# EAGLE design switch sheild 1 (EAGLE 8.3.1)
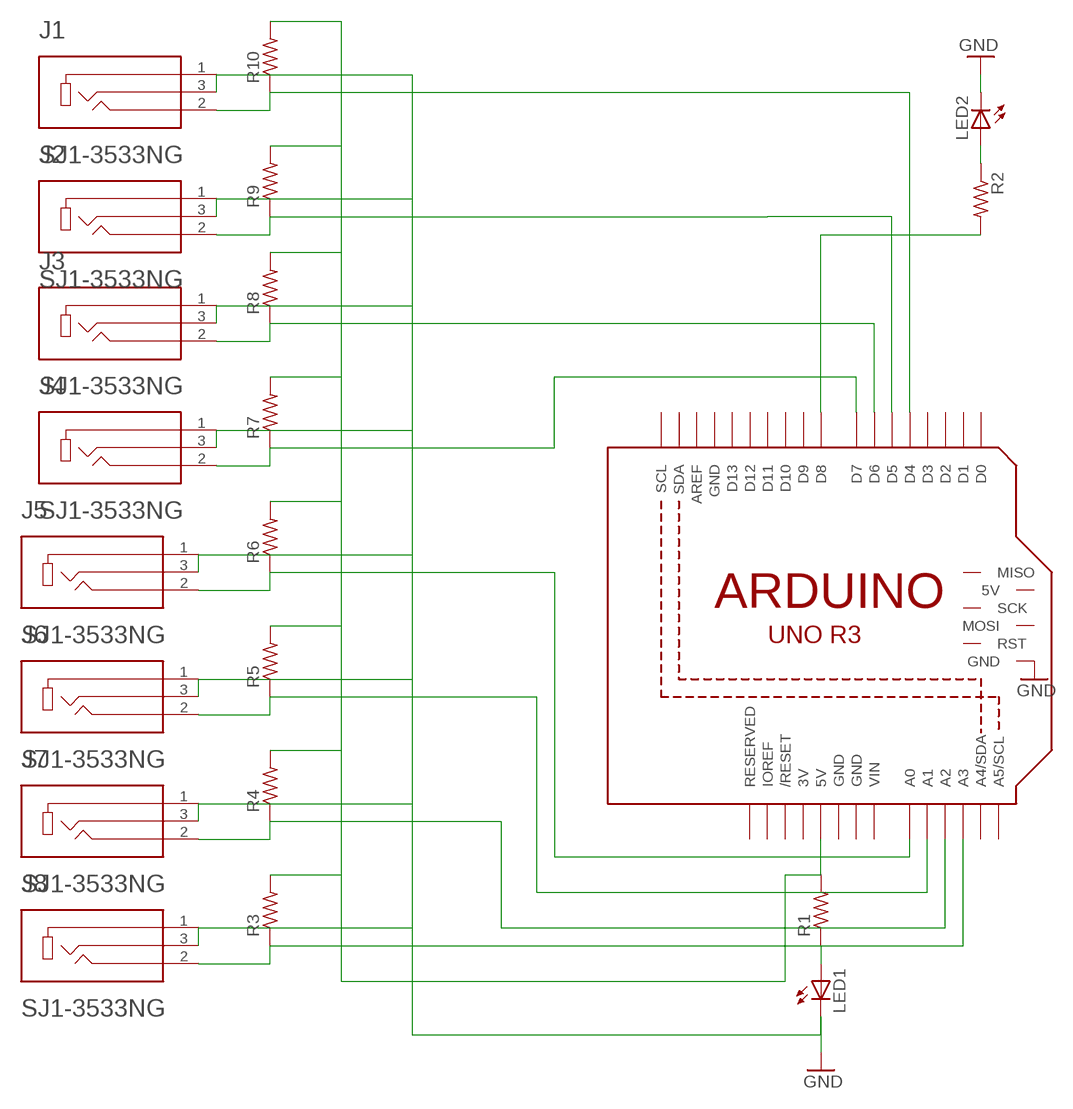
[diagram p0: schematic, sheet 1]

## Parts
J1  SJ1-3533NG  [CUI_SJ1-3533NG]
J2  SJ1-3533NG  [CUI_SJ1-3533NG]
J3  SJ1-3533NG  [CUI_SJ1-3533NG]
J4  SJ1-3533NG  [CUI_SJ1-3533NG]
J5  SJ1-3533NG  [CUI_SJ1-3533NG]
J6  SJ1-3533NG  [CUI_SJ1-3533NG]
J7  SJ1-3533NG  [CUI_SJ1-3533NG]
J8  SJ1-3533NG  [CUI_SJ1-3533NG]
LED1  LED3MM  [LED3MM]
LED2  LED3MM  [LED3MM]
M1  ARDUINO_R3_ICSP  [ARDUINOR3_ICSP]
R1  R-US_0207/5V  [0207/5V]
R2  R-US_0207/5V  [0207/5V]
R3  R-US_0207/5V  [0207/5V]
R4  R-US_0207/5V  [0207/5V]
R5  R-US_0207/5V  [0207/5V]
R6  R-US_0207/5V  [0207/5V]
R7  R-US_0207/5V  [0207/5V]
R8  R-US_0207/5V  [0207/5V]
R9  R-US_0207/5V  [0207/5V]
R10  R-US_0207/5V  [0207/5V]

## Nets
GND: J1.1 J1.3 J2.1 J2.3 J3.1 J3.3 J4.1 J4.3 J5.1 J5.3 J6.1 J6.3 J7.1 J7.3 J8.1 J8.3 LED1.K(C) LED2.K(C) M1.GND@2(GND)
N$1: M1.D8 R2.2
N$2: M1.5V R1.2 R3.2 R4.2 R5.2 R6.2 R7.2 R8.2 R9.2 R10.2
N$4: J1.2 M1.D4 R10.1
N$5: J2.2 M1.D5 R9.1
N$6: J3.2 M1.D6 R8.1
N$7: J4.2 M1.D7 R7.1
N$8: LED1.A R1.1
N$9: J5.2 M1.A0 R6.1
N$10: J6.2 M1.A1 R5.1
N$11: J7.2 M1.A2 R4.1
N$12: J8.2 M1.A3 R3.1
N$41: LED2.A R2.1
Unconnected: M1.5V_ICSP(5V) M1.A4(A4/SDA) M1.A5(A5/SCL) M1.AREF M1.D0 M1.D1 M1.D2 M1.D3 M1.D9 M1.D10 M1.D11 M1.D12 M1.D13 M1.IOREF M1.MISO M1.MOSI M1.RESERVED M1.RESET(/RESET) M1.RESET_ICSP(RST) M1.SCK M1.SCL M1.SDA

## Power pins joined to a net without a drawn wire
3V: M1.3V
GND: M1.GND M1.GND@1(GND) M1.GND@3(GND)
VIN: M1.VIN

## Library data of the parts
J1-J8 = SJ1-3533NG:SJ1-3533NG: 3.5 mm Right-Angle Stereo Jack, 3 Pin PCB Mount, Isolated Ground; MANUFACTURER: CUI; PARTREV: 1.02; STANDARD: Manufacturer recommendation
LED1 LED2 = adafruit:LED: LED OSRAM: - CHIPLED LG R971, LG N971, LY N971, LG Q971, LY Q971, LO R971, LY R971 LH N974, LH R974 LS Q976, LO Q976, LY Q976 LO Q996 - Hyper CHIPLED LW Q18S LB Q993, LB Q99A, LB R99A - SideLED LS A670, LO A670, LY A670, LG A670, LP A670 LB A673, LV A673, LT A673, LW A673 LH A674 LY A675 LS A676, LA A676, LO A676, LY A676, LW A676 LS A679, LY A679, LG A679 - Hyper Micro SIDELED® LS Y876, LA Y876, LO Y876, LY Y876 LT Y87S - SmartLED LW L88C, LW L88S LB L89C, LB L89S, LG L890 LS L89K, LO L89K, LY L89K LS L896, LA L896, LO L896, LY L896 - TOPLED LS T670, LO T670, LY T670, LG T670, LP T670 LSG T670, LSP T670, LSY T670, LOP T670, LYG T670 LG T671, LOG T671, LSG T671 LB T673, LV T673, LT T673, LW T673 LH T674 LS T676, LA T676, LO T676, LY T676, LB T676, LH T676, LSB T676, LW T676 LB T67C, LV T67C, LT T67C, LS T67K, LO T67K, LY T67K, LW E67C LS E67B, LA E67B, LO E67B, LY E67B, LB E67C, LV E67C, LT E67C LW T67C LS T679, LY T679, LG T679 LS T770, LO T770, LY T770, LG T770, LP T770 LB T773, LV T773, LT T773, LW T773 LH T774 LS E675, LA E675, LY E675, LS T675 LS T776, LA T776, LO T776, LY T776, LB T776 LHGB T686 LT T68C, LB T68C - Hyper Mini TOPLED® LB M676 - Mini TOPLED Santana® LG M470 LS M47K, LO M47K, LY M47K Source: http://www.osram.convergy.de/
M1 = adafruit:ARDUINO_R3_ICSP
R1-R10 = rcl-ez:R-US_: RESISTOR, American symbol

## Board
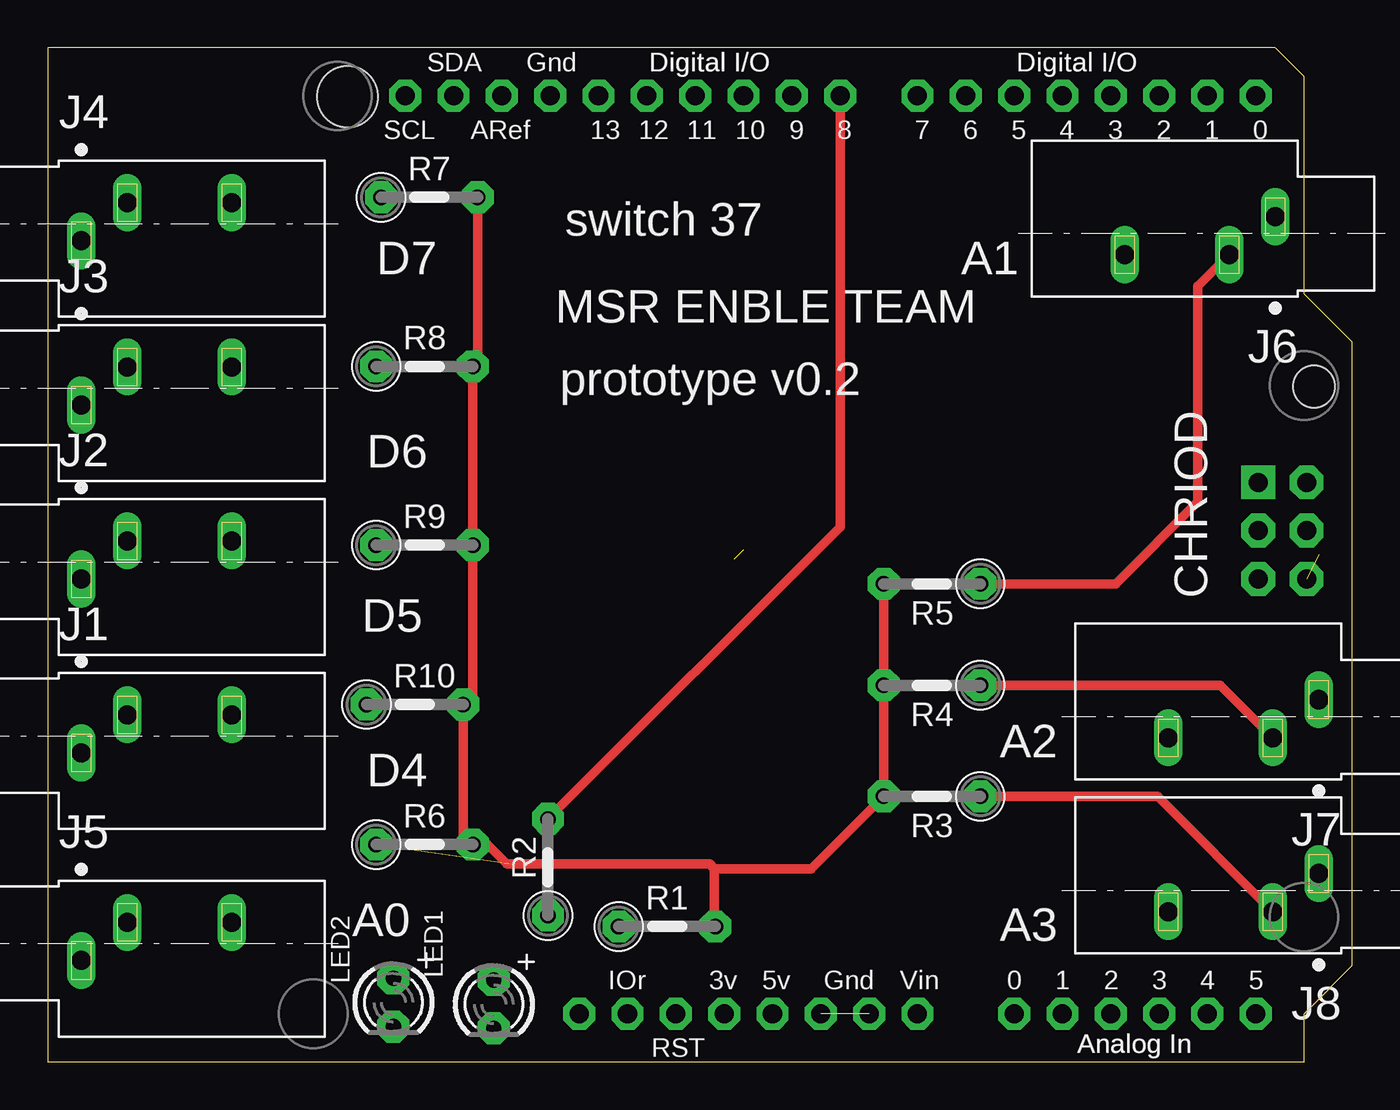
[diagram p1: board, top side]
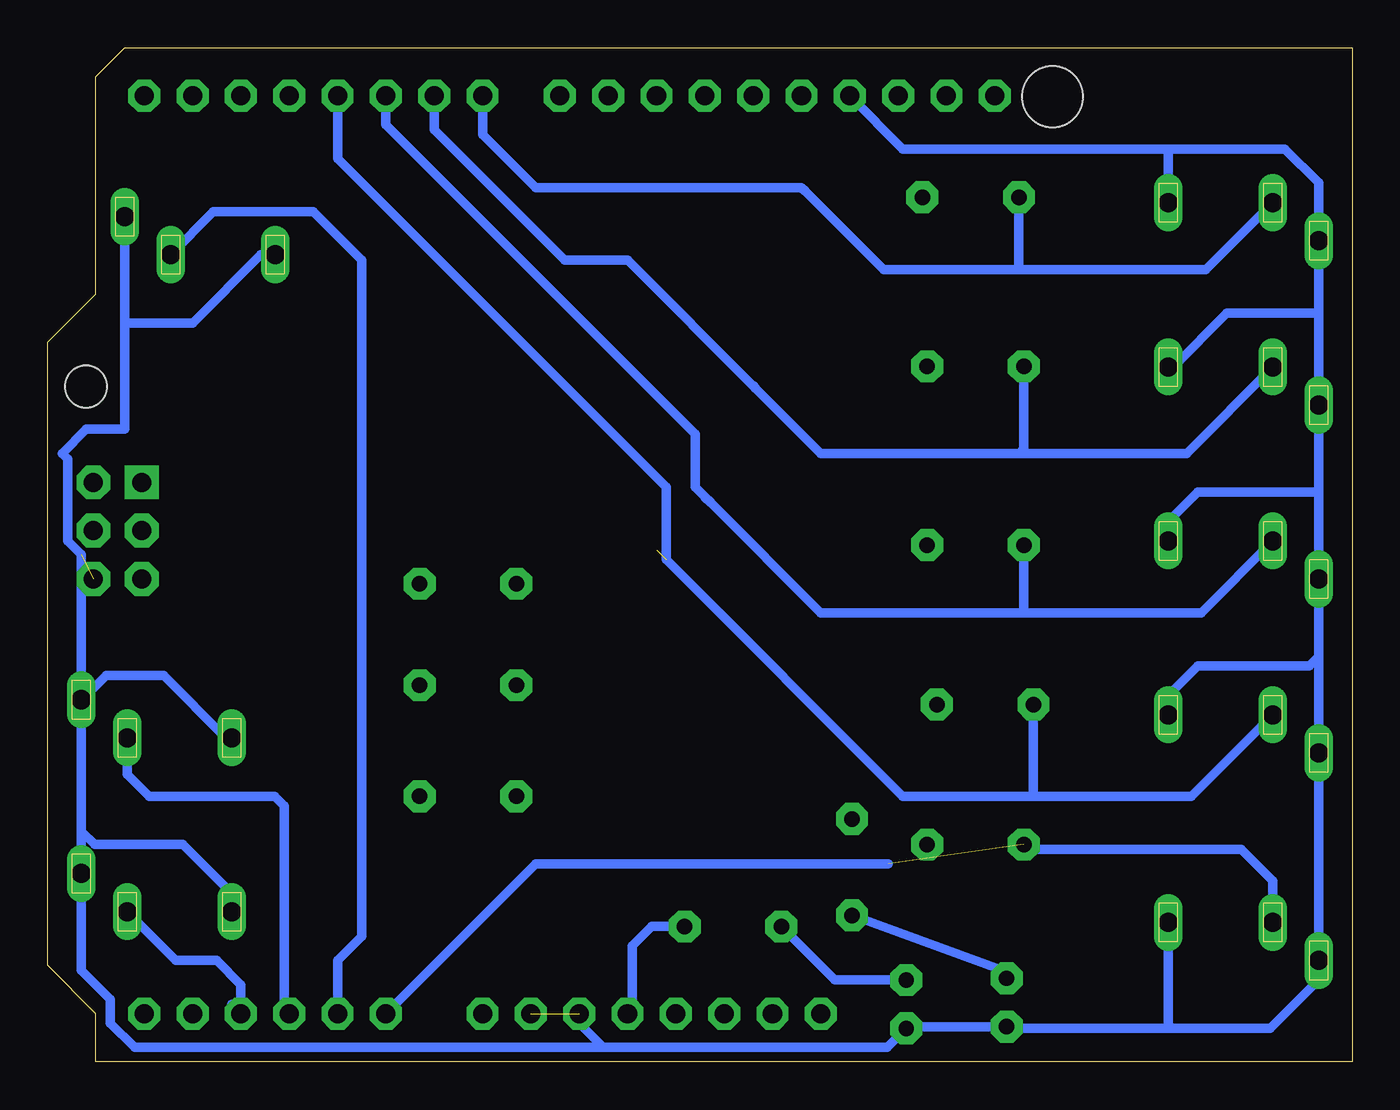
[diagram p2: board, bottom side, seen from below]

Size 68.58 x 53.34 mm. Coordinates in mm from the lower left corner, seen from the top.
Copper layers (1*16): Top 0.035mm / dielectric 1.5mm / Bottom 0.035mm
Design rules "adafruit": minimum track width 8mil, minimum drill 15.5mil, track to track 8mil, track to pad 8mil, pad to pad 8mil, via to via 8mil, smd to smd 8mil, copper to edge 10mil, drill to drill 8mil, minimum pad ring 10mil, minimum via ring 8mil, stop-mask expansion 2mil, vias tented up to drill 20mil, thermal gap 10mil
Holes 3.2 mm at 15.76,50.75
Holes 2.2 mm at 66.56,35.51

### Footprints (pad centres in the part's own frame; a part is rotated, then mirrored left to right if it is on the bottom)
CUI_SJ1-3533NG = drill 1 long: 1 0,0; 2 2.4,2; 3 7.9,2
LED3MM = drill 0.813 pad 1.676 octagon: A -1.27,0; K 1.27,0
ARDUINOR3_ICSP = drill 1 pad 1.676 octagon: 3V 35.56,2.54; 5V 38.1,2.54; A0 50.8,2.54; A1 53.34,2.54; A2 55.88,2.54; A3 58.42,2.54; A4 60.96,2.54; A5 63.5,2.54; AREF 23.876,50.8; D0 63.5,50.8; D1 60.96,50.8; D2 58.42,50.8; D3 55.88,50.8; D4 53.34,50.8; D5 50.8,50.8; D6 48.26,50.8; D7 45.72,50.8; D8 41.656,50.8; D9 39.116,50.8; D10 36.576,50.8; D11 34.036,50.8; D12 31.496,50.8; D13 28.956,50.8; GND 26.416,50.8; GND@1 43.18,2.54; GND@2 40.64,2.54; IOREF 30.48,2.54; RESERVED 27.94,2.54; RESET 33.02,2.54; SCL 18.796,50.8; SDA 21.336,50.8; VIN 45.72,2.54 | drill 1 pad 1.778 octagon: 5V_ICSP 66.167,30.48; GND@3 66.167,25.4; MOSI 66.167,27.94; RESET_ICSP 63.627,25.4; SCK 63.627,27.94 | drill 1 pad 1.778 square: MISO 63.627,30.48
0207/5V = drill 0.813 pad 1.676 octagon: 1 -2.54,0; 2 2.54,0

### Placement (x,y rotation side)
J1  1.78,16.26 0 top
J2  1.78,25.4 0 top
J3  1.78,34.54 0 top
J4  1.78,43.18 0 top
J5  1.78,5.33 0 top
J6  64.52,44.45 180 top
J7  66.8,19.05 180 top
J8  66.8,9.91 180 top
LED1  23.45,3.04 270 top
LED2  18.17,3.13 270 top
M1  0,0 0 top
R1  32.56,7.12 0 top
R2  26.3,10.24 90 top
R3  46.48,13.97 180 top
R4  46.48,19.81 180 top
R5  46.48,25.15 180 top
R6  19.81,11.43 0 top
R7  20.07,45.47 0 top
R8  19.81,36.58 0 top
R9  19.81,27.18 0 top
R10  19.3,18.8 0 top

### Tracks (layer width: path | path; a pad name or v marks a point on that pad's centre or on a via)
GND  (2 unrouted)
  Bottom 0.508: 66.55,25.02 M1.GND@3 | 9.48,1.78 4.32,1.78 1.78,4.32 J5.1 1.78,16.12 J1.1 1.78,21.33 | 9.48,1.78 18.09,1.78 LED2.K 23.36,1.86 LED1.K 24.45,0.76 39.37,0.76 | M1.GND@2 40.64,2.03 39.37,0.76 | 1.78,21.33 1.78,25.07 J2.1 1.78,30.02 | 1.78,30.02 J3.1 1.78,39.28 | 1.78,39.28 J4.1 1.78,46.23 3.56,48.01 9.49,48.01 | 9.49,48.01 23.62,48.01 M1.GND | 64.52,38.71 J6.1 | 64.52,38.71 64.52,33.27 66.55,33.27 67.82,32 67.51,31.7 67.51,27.38 66.8,26.67 J7.1 | 66.8,19.01 66.8,18.68 | 66.8,19.01 J7.1 | 66.8,12.13 66.8,10.2 | 66.8,12.13 66.8,19.01 | 66.8,19.01 J7.1 | 66.8,10.2 J8.1 | 39.37,0.76 64.01,0.76 65.28,2.03 65.28,3.3 66.8,4.83 66.8,10.2 | J4.3 9.68,47.82 9.49,48.01 | J3.3 9.43,36.54 6.6,39.37 1.87,39.37 1.78,39.28 | J2.3 9.68,28.42 8.13,29.97 1.82,29.97 1.78,30.02 | J1.3 9.68,19.28 8.13,20.83 2.28,20.83 1.78,21.33 | J6.3 57.37,42.45 60.96,38.86 64.36,38.86 64.52,38.71 | J7.3 59.21,17.05 62.48,20.32 65.49,20.32 66.8,19.01 | J5.3 9.68,1.98 9.48,1.78 | J8.3 58.9,8.86 61.47,11.43 66.1,11.43 66.8,12.13
N$1
  Top 0.508: M1.D8 41.66,28.14 R2.2
N$2
  Top 0.508: R7.2 22.61,36.83 R8.2 R9.2 22.35,19.3 R10.2 21.84,11.94 R6.2 23.11,11.43 24.13,10.41 34.8,10.41 35.05,10.16 | 35.05,10.16 35.05,7.08 | 35.05,6.6 35.05,7.08 | 35.05,7.08 R1.2 | 35.05,10.16 40.13,10.16 R3.2 R4.2 R5.2
  Bottom 0.508: R1.2 36.82,7.12 37.85,6.1 37.85,2.79 M1.5V
N$4  (1 unrouted)
  Bottom 0.508: J1.2 8.46,13.97 16.74,13.97 | 16.74,13.97 23.62,13.97 36.07,26.42 36.07,30.23 53.34,47.5 M1.D4 | R10.1 16.76,14 16.74,13.97
N$5
  Bottom 0.508: 33.73,29.41 34.04,29.72 | 33.73,29.41 27.94,23.62 17.29,23.62 | J2.2 7.96,23.62 17.29,23.62 | R9.1 17.27,23.64 17.29,23.62 | M1.D5 50.8,49.28 34.54,33.02 34.54,30.23 33.73,29.41
N$6
  Bottom 0.508: 31.36,35.42 31.5,35.56 | 31.36,35.42 27.94,32 17.49,32 | J3.2 8.72,32 17.49,32 | R8.1 17.27,32.22 17.49,32 | M1.D6 48.26,49.02 41.4,42.16 38.1,42.16 31.36,35.42
N$7
  Bottom 0.508: 28.76,45.78 28.96,45.97 | 28.76,45.78 24.64,41.66 17.57,41.66 | J4.2 7.7,41.66 17.57,41.66 | R7.1 17.53,41.7 17.57,41.66 | M1.D7 45.72,48.77 42.93,45.97 28.96,45.97 | 28.96,45.97 28.76,45.78
N$8
  Bottom 0.508: LED1.A 27.2,4.31 R1.1
N$9  (1 unrouted)
  Bottom 0.508: 24.38,10.41 42.93,10.41 M1.A0 | J5.2 4.18,9.51 5.84,11.18 17.02,11.18 R6.1
N$10
  Top 0.508: R5.1 56.13,25.15 60.45,29.46 60.45,40.79 J6.2
  Bottom 0.508: M1.A1 53.34,5.33 52.07,6.6 52.07,42.16 54.61,44.7 59.86,44.7 J6.2
N$11
  Top 0.508: R4.1 61.64,19.81 J7.2
  Bottom 0.508: J7.2 64.4,15.13 63.25,13.97 56.64,13.97 56.13,13.46 56.13,2.79 M1.A2
N$12
  Top 0.508: R3.1 58.34,13.97 J8.2
  Bottom 0.508: 58.9,3.02 M1.A3 58.42,4.06 59.69,5.33 61.83,5.33 J8.2
N$41
  Bottom 0.508: LED2.A 18.17,4.75 R2.1

### Text on the board
tPlace: Digital I/O | Digital I/O | switch 37 | D7 | A1 | MSR ENBLE TEAM | prototype v0.2 | D6 | CHRIOD | D5 | A2 | D4 | A0 | A3 | Analog In